# EAGLE design march_23_20_power_board1_v2.0 (EAGLE 9.5.1)
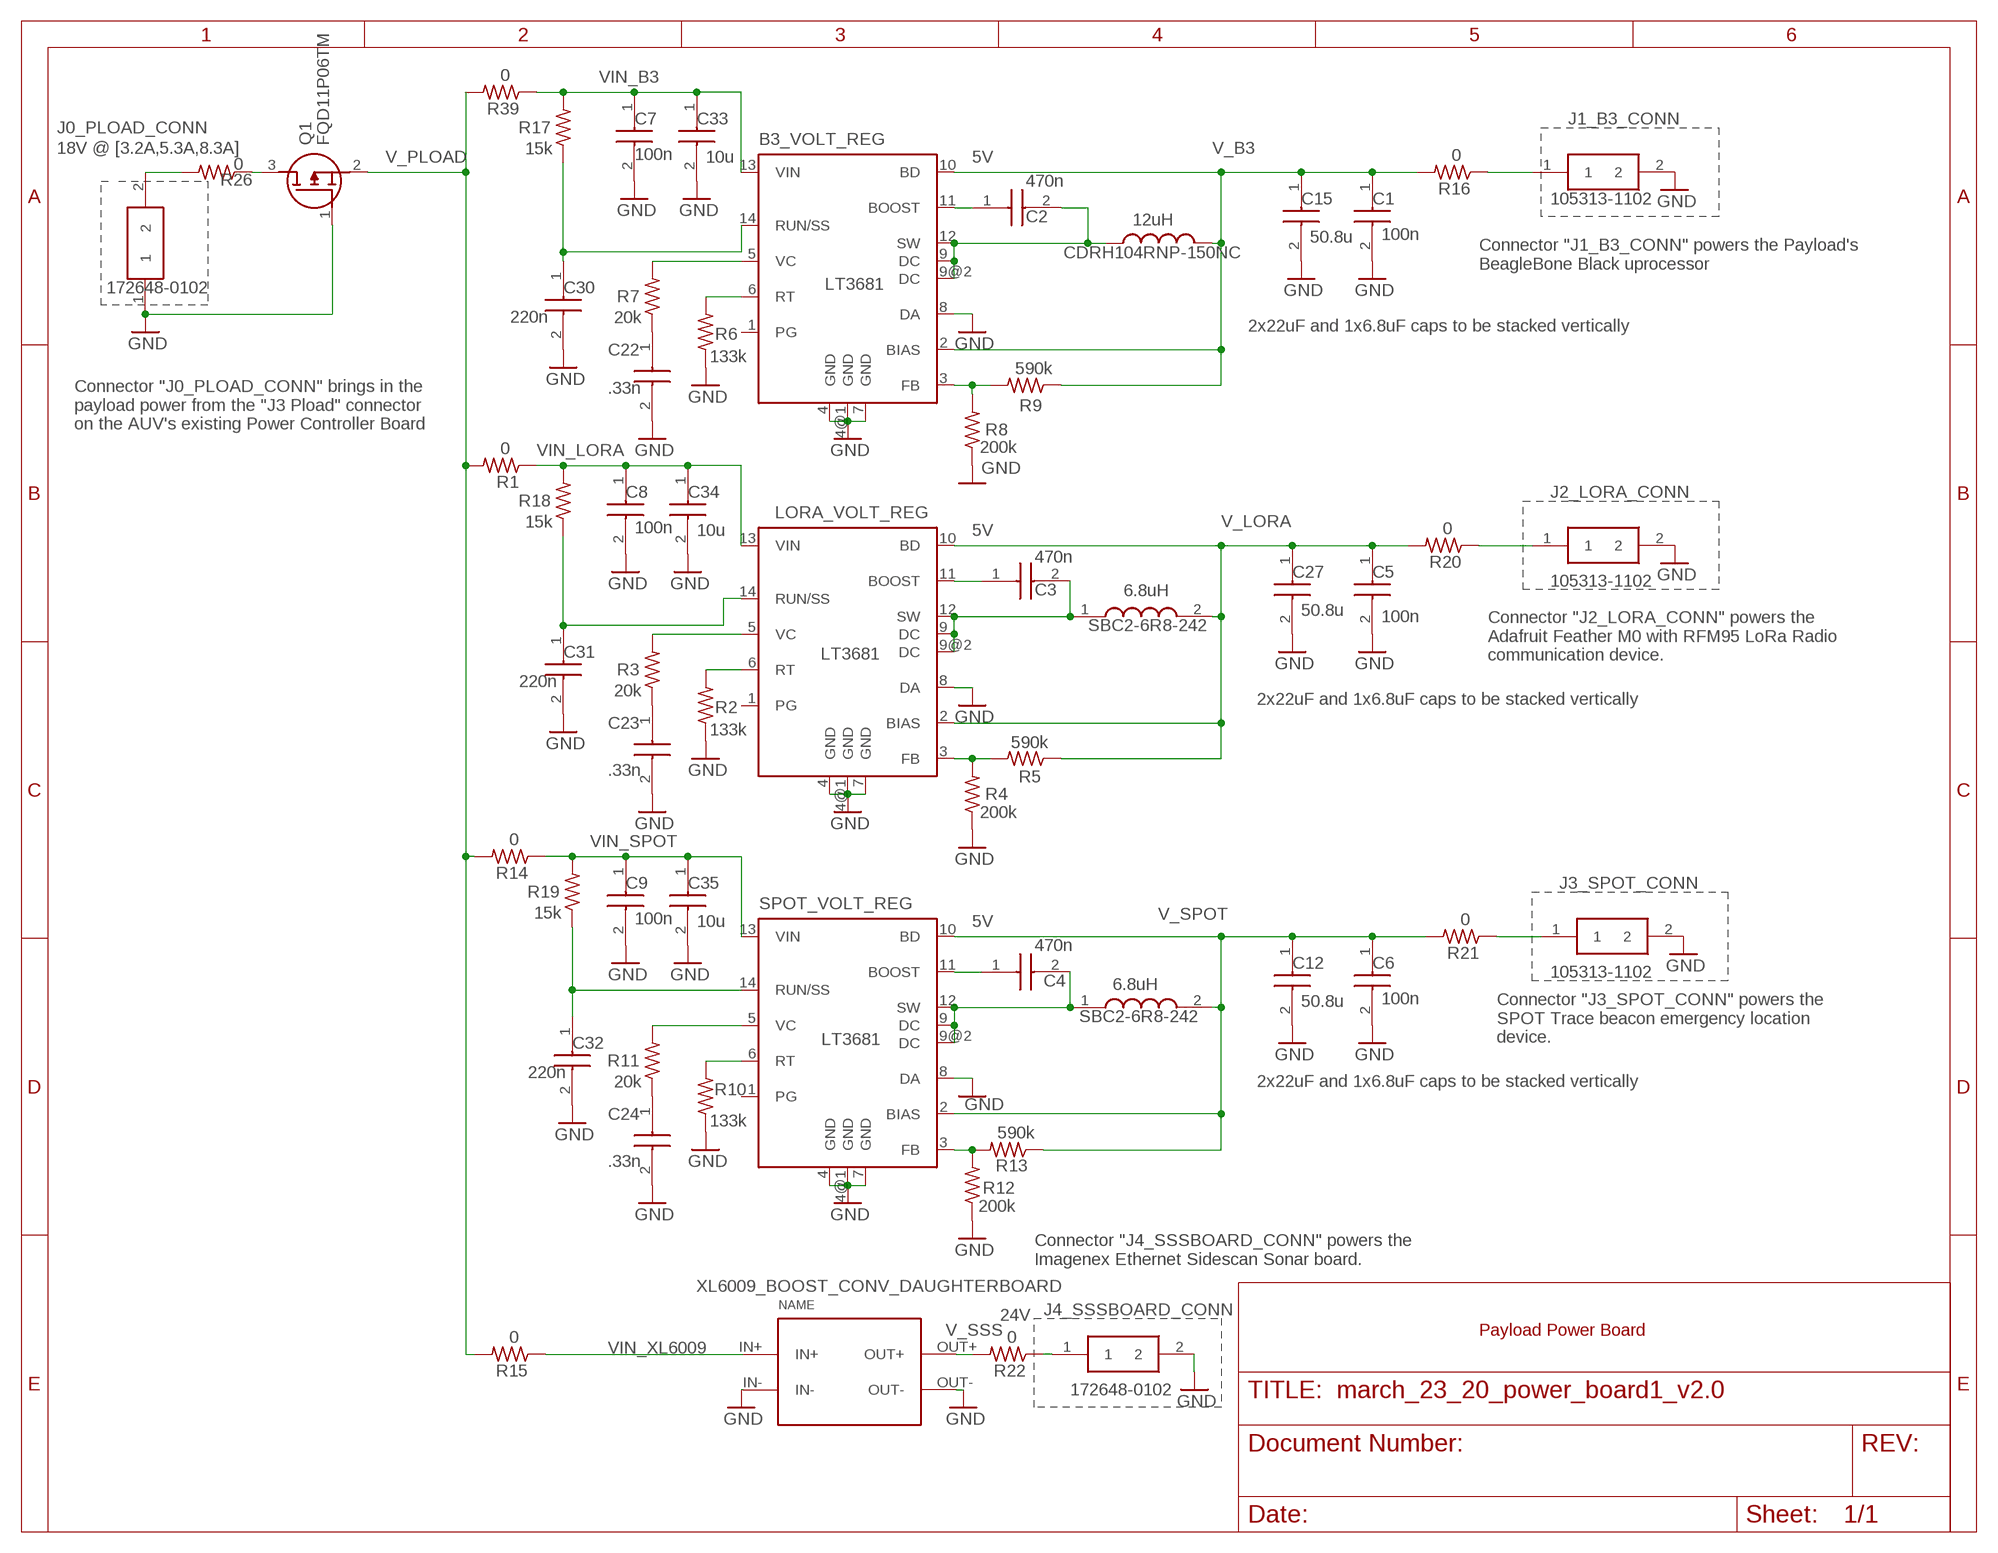
[diagram p0: schematic, sheet 1]

## Parts
B3_VOLT_REG  LT3681  [DFN14-4X3DE]
C1  100n  06033C104KAT4A  [CAPC1608X90N]
C2  470n  06033C474JAT2A  [CAPC1608X90N]
C3  470n  06033C474JAT2A  [CAPC1608X90N]
C4  470n  06033C474JAT2A  [CAPC1608X90N]
C5  100n  06033C104KAT4A  [CAPC1608X90N]
C6  100n  06033C104KAT4A  [CAPC1608X90N]
C7  100n  06031C104KAT2A  [CAPC1608X90N]
C8  100n  06031C104KAT2A  [CAPC1608X90N]
C9  100n  06031C104KAT2A  [CAPC1608X90N]
C12  50.8u  12103C226KAT2A  [CAPC3225X279N]
C15  50.8u  12103C226KAT2A  [CAPC3225X279N]
C22  .33n  08053C334KAT2A  [CAPC2012X140N]
C23  .33n  08053C334KAT2A  [CAPC2012X140N]
C24  .33n  08053C334KAT2A  [CAPC2012X140N]
C27  50.8u  12103C226KAT2A  [CAPC3225X279N]
C30  220n  08051C224KAT2A  [CAPC2012X140N]
C31  220n  08051C224KAT2A  [CAPC2012X140N]
C32  220n  08051C224KAT2A  [CAPC2012X140N]
C33  10u  22201C106KAT2A  [CAPC5750X279N]
C34  10u  22201C106KAT2A  [CAPC5750X279N]
C35  10u  22201C106KAT2A  [CAPC5750X279N]
INDUCTOR_3  CDRH104RNP-150NC  [INDPM102100X400N]
J0_PLOAD_CONN  172648-0102  [1726480102]
J1_B3_CONN  105313-1102  [1053131102]
J2_LORA_CONN  105313-1102  [1053131102]
J3_SPOT_CONN  105313-1102  [1053131102]
J4_SSSBOARD_CONN  172648-0102  [1726480102]
L4  SBC2-6R8-242  [SBC26R8242]
L5  SBC2-6R8-242  [SBC26R8242]
LORA_VOLT_REG  LT3681  [DFN14-4X3DE]
Q1  FQD11P06TM  [DPAK3-CASE-369AS]
R1  0  R-US_0207/2V  [0207/2V]
R2  133k  R-US_R0603  [R0603]
R3  20k  R-US_R0603  [R0603]
R4  200k  R-US_R0603  [R0603]
R5  590k  R-US_R0603  [R0603]
R6  133k  R-US_R0603  [R0603]
R7  20k  R-US_R0603  [R0603]
R8  200k  R-US_R0603  [R0603]
R9  590k  R-US_R0603  [R0603]
R10  133k  R-US_R0603  [R0603]
R11  20k  R-US_R0603  [R0603]
R12  200k  R-US_R0603  [R0603]
R13  590k  R-US_R0603  [R0603]
R14  0  R-US_0207/2V  [0207/2V]
R15  0  R-US_0207/2V  [0207/2V]
R16  0  R-US_0207/2V  [0207/2V]
R17  15k  R-US_R0603  [R0603]
R18  15k  R-US_R0603  [R0603]
R19  15k  R-US_R0603  [R0603]
R20  0  R-US_0207/2V  [0207/2V]
R21  0  R-US_0207/2V  [0207/2V]
R22  0  R-US_0207/2V  [0207/2V]
R26  0  R-US_0207/2V  [0207/2V]
R39  0  R-US_0207/2V  [0207/2V]
SPOT_VOLT_REG  LT3681  [DFN14-4X3DE]
XL6009_BOOST_CONV_DAUGHTERBOARD  CP8-ADJ  [CP8-ADJ]

## Nets
CBOOST_B3: B3_VOLT_REG.11(BOOST) C2.1
CBOOST_LORA: C3.1 LORA_VOLT_REG.11(BOOST)
CBOOST_SPOT: C4.1 SPOT_VOLT_REG.11(BOOST)
FB_B3: B3_VOLT_REG.3(FB) R8.2 R9.2
FB_LORA: LORA_VOLT_REG.3(FB) R4.2 R5.2
FB_SPOT: R12.2 R13.2 SPOT_VOLT_REG.3(FB)
GND: B3_VOLT_REG.4(GND) B3_VOLT_REG.4@1(GND) B3_VOLT_REG.7(GND) B3_VOLT_REG.8(DA) C1.2 C5.2 C6.2 C7.2 C8.2 C9.2 C12.2 C15.2 C22.2 C23.2 C24.2 C27.2 C30.2 C31.2 C32.2 C33.2 C34.2 C35.2 J0_PLOAD_CONN.1 J1_B3_CONN.2 J2_LORA_CONN.2 J3_SPOT_CONN.2 J4_SSSBOARD_CONN.2 LORA_VOLT_REG.4(GND) LORA_VOLT_REG.4@1(GND) LORA_VOLT_REG.7(GND) LORA_VOLT_REG.8(DA) Q1.1(G) R2.1 R4.1 R6.1 R8.1 R10.1 R12.1 SPOT_VOLT_REG.4(GND) SPOT_VOLT_REG.4@1(GND) SPOT_VOLT_REG.7(GND) SPOT_VOLT_REG.8(DA) XL6009_BOOST_CONV_DAUGHTERBOARD.IN- XL6009_BOOST_CONV_DAUGHTERBOARD.OUT-
N$1: C22.1 R7.1
N$2: C23.1 R3.1
N$4: C24.1 R11.1
RT_B3: B3_VOLT_REG.6(RT) R6.2
RT_LORA: LORA_VOLT_REG.6(RT) R2.2
RT_SPOT: R10.2 SPOT_VOLT_REG.6(RT)
RUN/SS_B3: B3_VOLT_REG.14(RUN/SS) C30.1 R17.1
RUN/SS_LORA: C31.1 LORA_VOLT_REG.14(RUN/SS) R18.1
RUN/SS_SPOT: C32.1 R19.1 SPOT_VOLT_REG.14(RUN/SS)
SW_B3: B3_VOLT_REG.9(DC) B3_VOLT_REG.9@2(DC) B3_VOLT_REG.12(SW) C2.2 INDUCTOR_3.1
SW_LORA: C3.2 L5.1 LORA_VOLT_REG.9(DC) LORA_VOLT_REG.9@2(DC) LORA_VOLT_REG.12(SW)
SW_SPOT: C4.2 L4.1 SPOT_VOLT_REG.9(DC) SPOT_VOLT_REG.9@2(DC) SPOT_VOLT_REG.12(SW)
V_B3: B3_VOLT_REG.2(BIAS) B3_VOLT_REG.10(BD) C1.1 C15.1 INDUCTOR_3.2 R9.1 R16.2
V_B31: J1_B3_CONN.1 R16.1
V_LORA: C5.1 C27.1 L5.2 LORA_VOLT_REG.2(BIAS) LORA_VOLT_REG.10(BD) R5.1 R20.2
V_LORA1: J2_LORA_CONN.1 R20.1
V_PLOAD: Q1.2(S) R1.2 R14.2 R15.2 R39.2
V_PLOAD0: Q1.3(D) R26.1
V_PLOAD00: J0_PLOAD_CONN.2 R26.2
V_SPOT: C6.1 C12.1 L4.2 R13.1 R21.2 SPOT_VOLT_REG.2(BIAS) SPOT_VOLT_REG.10(BD)
V_SPOT1: J3_SPOT_CONN.1 R21.1
V_SSS: R22.2 XL6009_BOOST_CONV_DAUGHTERBOARD.OUT+
V_SSS1: J4_SSSBOARD_CONN.1 R22.1
VC_B3: B3_VOLT_REG.5(VC) R7.2
VC_LORA: LORA_VOLT_REG.5(VC) R3.2
VC_SPOT: R11.2 SPOT_VOLT_REG.5(VC)
VIN_B3: B3_VOLT_REG.13(VIN) C7.1 C33.1 R17.2 R39.1
VIN_LORA: C8.1 C34.1 LORA_VOLT_REG.13(VIN) R1.1 R18.2
VIN_SPOT: C9.1 C35.1 R14.1 R19.2 SPOT_VOLT_REG.13(VIN)
VIN_XL6009: R15.1 XL6009_BOOST_CONV_DAUGHTERBOARD.IN+
Unconnected: B3_VOLT_REG.1(PG) LORA_VOLT_REG.1(PG) SPOT_VOLT_REG.1(PG)

## Notes on the sheet
- 18V @ [3.2A,5.3A,8.3A]
- 10u | 5V
- 12uH
- 50.8u
- Connector "J1_B3_CONN" powers the Payload's
  BeagleBone Black uprocessor
- 220n
- 2x22uF and 1x6.8uF caps to be stacked vertically
- .33n
- Connector "J0_PLOAD_CONN" brings in the 
  payload power from the "J3 Pload" connector 
  on the AUV's existing Power Controller Board
- 10u | 5V
- 470n
- 6.8uH
- 50.8u
- Connector "J2_LORA_CONN" powers the 
  Adafruit Feather M0 with RFM95 LoRa Radio
  communication device.
- 220n
- 2x22uF and 1x6.8uF caps to be stacked vertically
- .33n
- 10u | 5V
- 6.8uH
- 50.8u
- Connector "J3_SPOT_CONN" powers the 
  SPOT Trace beacon emergency location
  device.
- 220n
- 2x22uF and 1x6.8uF caps to be stacked vertically
- .33n
- Connector "J4_SSSBOARD_CONN" powers the 
  Imagenex Ethernet Sidescan Sonar board.
- XL6009_BOOST_CONV_DAUGHTERBOARD
- 24V
- Payload Power Board

## Library data of the parts
B3_VOLT_REG LORA_VOLT_REG SPOT_VOLT_REG = linear-technology:LT3681: 36V, 2A, 2.8MHz Step-Down Switching Regulator with Integrated Power Schottky Diode Source: http://www.linear.com/pc/downloadDocument.do?navId=H0,C1,C1003,C1042,C1032,C1064,P38040,D25144; MPN: LT3681EDE#PBF; OC_FARNELL: 1627603; OC_NEWARK: 57M8550
C1 C5 C6 = 06033C104KAT4A:06033C104KAT4A: Multilayer Ceramic Capacitors MLCC - SMD/SMT 25volts 0.1uF 10% X7R Source: Datasheet <http://www.mouser.com/catalog/supplier/library/pdf/AVXSurfaceMountCeramic.pdf>; DESCRIPTION: Multilayer Ceramic Capacitors MLCC - SMD/SMT 25volts 0.1uF 10% X7R; HEIGHT: 0.9mm; MANUFACTURER_NAME: AVX; MANUFACTURER_PART_NUMBER: 06033C104KAT4A; MOUSER_PART_NUMBER: 581-06033C104KAT4A; MOUSER_PRICE-STOCK: https://www.mouser.com/Search/Refine.aspx?Keyword=581-06033C104KAT4A
C2-C4 = 06033C474JAT2A:06033C474JAT2A: Multilayer Ceramic Capacitors MLCC - SMD/SMT 25V 470nF X7R 0603 +5% Source: Datasheet <https://componentsearchengine.com/Datasheets/1/06031A100FAT2A.pdf>; DESCRIPTION: Multilayer Ceramic Capacitors MLCC - SMD/SMT 25V 470nF X7R 0603 +5%; HEIGHT: 0.9mm; MANUFACTURER_NAME: AVX; MANUFACTURER_PART_NUMBER: 06033C474JAT2A; MOUSER_PART_NUMBER: 581-06033C474JAT2A; MOUSER_PRICE-STOCK: https://www.mouser.com/Search/Refine.aspx?Keyword=581-06033C474JAT2A
C7-C9 = 06031C104KAT2A:06031C104KAT2A: AVX - 06031C104KAT2A - CAP, MLCC, X7R, 0.1UF, 100V, 0603 Source: Datasheet <https://componentsearchengine.com/Datasheets/1/06031A100FAT2A.pdf>; DESCRIPTION: AVX - 06031C104KAT2A - CAP, MLCC, X7R, 0.1UF, 100V, 0603; HEIGHT: 0.9mm; MANUFACTURER_NAME: AVX; MANUFACTURER_PART_NUMBER: 06031C104KAT2A; MOUSER_PART_NUMBER: 581-06031C104KAT2A; MOUSER_PRICE-STOCK: https://www.mouser.com/Search/Refine.aspx?Keyword=581-06031C104KAT2A
C12 C15 C27 = 12103C226KAT2A:12103C226KAT2A: Multilayer Ceramic Capacitors MLCC - SMD/SMT 25V 22uF X7R 1210 0.1 Source: Datasheet <https://componentsearchengine.com/Datasheets/1/12103C226KAT2A.pdf>; DESCRIPTION: Multilayer Ceramic Capacitors MLCC - SMD/SMT 25V 22uF X7R 1210 0.1; HEIGHT: 2.79mm; MANUFACTURER_NAME: AVX; MANUFACTURER_PART_NUMBER: 12103C226KAT2A; MOUSER_PART_NUMBER: 581-12103C226KAT2A; MOUSER_PRICE-STOCK: https://www.mouser.com/Search/Refine.aspx?Keyword=581-12103C226KAT2A
C22-C24 = 08053C334KAT2A:08053C334KAT2A: AVX 0805 Standard 0.33uF Ceramic Multilayer Capacitor, 25 V dc, +125 Source: Datasheet <http://datasheets.avx.com/X7RDielectric.pdf>; DESCRIPTION: AVX 0805 Standard 0.33uF Ceramic Multilayer Capacitor, 25 V dc, +125; HEIGHT: 1.4mm; MANUFACTURER_NAME: AVX; MANUFACTURER_PART_NUMBER: 08053C334KAT2A; MOUSER_PART_NUMBER: 581-08053C334KAT2A; MOUSER_PRICE-STOCK: https://www.mouser.com/Search/Refine.aspx?Keyword=581-08053C334KAT2A; RS_PART_NUMBER: 1747387; RS_PRICE-STOCK: http://uk.rs-online.com/web/p/products/1747387
C30-C32 = 08051C224KAT2A:08051C224KAT2A: Cap Ceramic 0.22uF 100V X7R 10% Pad SMD 0805 125C T/R Source: Datasheet <https://www.mouser.com/datasheet/2/40/X7RDielectric-777024.pdf>; DESCRIPTION: Cap Ceramic 0.22uF 100V X7R 10% Pad SMD 0805 125C T/R; HEIGHT: 1.4mm; MANUFACTURER_NAME: AVX; MANUFACTURER_PART_NUMBER: 08051C224KAT2A; MOUSER_PART_NUMBER: 581-08051C224KAT2A; MOUSER_PRICE-STOCK: https://www.mouser.com/Search/Refine.aspx?Keyword=581-08051C224KAT2A
C33-C35 = 22201C106KAT2A:22201C106KAT2A: Cap Ceramic 10uF 100V X7R 10% Pad SMD 2220 125C T/R Source: Datasheet <https://www.mouser.com/datasheet/2/40/X7RDielectric-777024.pdf>; DESCRIPTION: Cap Ceramic 10uF 100V X7R 10% Pad SMD 2220 125C T/R; HEIGHT: 2.79mm; MANUFACTURER_NAME: AVX; MANUFACTURER_PART_NUMBER: 22201C106KAT2A; MOUSER_PART_NUMBER: 581-22201C106KAT2A; MOUSER_PRICE-STOCK: https://www.mouser.com/Search/Refine.aspx?Keyword=581-22201C106KAT2A
INDUCTOR_3 = CDRH104RNP-150NC:CDRH104RNP-150NC: Fixed Inductors 15uH 3.1A Source: Datasheet <http://products.sumida.com/products/pdf/CDRH104R.pdf>; DESCRIPTION: Fixed Inductors 15uH 3.1A; HEIGHT: 4mm; MANUFACTURER_NAME: Sumida; MANUFACTURER_PART_NUMBER: CDRH104RNP-150NC; MOUSER_PART_NUMBER: 851-CDRH104RNP-150NC; MOUSER_PRICE-STOCK: https://www.mouser.com/Search/Refine.aspx?Keyword=851-CDRH104RNP-150NC
J0_PLOAD_CONN J4_SSSBOARD_CONN = 172648-0102:172648-0102: Board to Board & Mezzanine Connectors Source: Datasheet <https://www.molex.com/pdm_docs/sd/1726480102_sd.pdf>; DESCRIPTION: Board to Board & Mezzanine Connectors; HEIGHT: 5.4mm; MANUFACTURER_NAME: Molex; MANUFACTURER_PART_NUMBER: 172648-0102; MOUSER_PART_NUMBER: 538-172648-0102; MOUSER_PRICE-STOCK: https://www.mouser.com/Search/Refine.aspx?Keyword=538-172648-0102
J1_B3_CONN J2_LORA_CONN J3_SPOT_CONN = 105313-1102:105313-1102: Molex Nano-Fit 105313, 2.5mm Pitch, 2 Way, 1 Row, Right Angle PCB Header, Through Hole Source: Datasheet <https://www.molex.com/molex/products/datasheet.jsp?part=active/1053131102_PCB_HEADERS.xml&channel=Products&Lang=en-US>; DESCRIPTION: Molex Nano-Fit 105313, 2.5mm Pitch, 2 Way, 1 Row, Right Angle PCB Header, Through Hole; HEIGHT: 6.84mm; MANUFACTURER_NAME: Molex; MANUFACTURER_PART_NUMBER: 105313-1102; MOUSER_PART_NUMBER: 538-105313-1102; MOUSER_PRICE-STOCK: https://www.mouser.com/Search/Refine.aspx?Keyword=538-105313-1102; RS_PART_NUMBER: 1623686; RS_PRICE-STOCK: http://uk.rs-online.com/web/p/products/1623686
L4 L5 = SBC2-6R8-242:SBC2-6R8-242: Fixed Inductors 6.8uH 20% 2.4A DCR=50mOhms Source: Datasheet <https://www.mouser.com/datasheet/2/212/KEM_L9007_SBC-1102894.pdf>; DESCRIPTION: Fixed Inductors 6.8uH 20% 2.4A DCR=50mOhms; HEIGHT: 8mm; MANUFACTURER_NAME: Kemet; MANUFACTURER_PART_NUMBER: SBC2-6R8-242; MOUSER_PART_NUMBER: 80-SBC2-6R8-242; MOUSER_PRICE-STOCK: https://www.mouser.com/Search/Refine.aspx?Keyword=80-SBC2-6R8-242
Q1 = FQD11P06TM:FQD11P06TM: FQD11P06TM P-Channel MOSFET, 9.4 A, 60 V, 3-Pin DPAK ON Semiconductor Source: Datasheet <https://www.onsemi.com/pub/Collateral/FQU11P06-D.pdf>; DESCRIPTION: FQD11P06TM P-Channel MOSFET, 9.4 A, 60 V, 3-Pin DPAK ON Semiconductor; HEIGHT: mm; MANUFACTURER_NAME: ON Semiconductor; MANUFACTURER_PART_NUMBER: FQD11P06TM; MOUSER_PART_NUMBER: 512-FQD11P06TM; MOUSER_PRICE-STOCK: https://www.mouser.com/Search/Refine.aspx?Keyword=512-FQD11P06TM; RS_PART_NUMBER: 6710949P; RS_PRICE-STOCK: http://uk.rs-online.com/web/p/products/6710949P
R1 R14-R16 R20-R22 R26 R39 = rcl:R-US_: RESISTOR, American symbol; DESC: RES SMD 10K OHM 1% 1/8W 0805; MFR: Yageo; MPN: RC0805FR-0710KL; SPICEPREFIX: R
R2-R13 R17-R19 = rcl:R-US_: RESISTOR, American symbol; SPICEPREFIX: R
XL6009_BOOST_CONV_DAUGHTERBOARD = userlib:CP8-ADJ: Voltage regulator IN: 7-35V OUT: ADJ

## Board
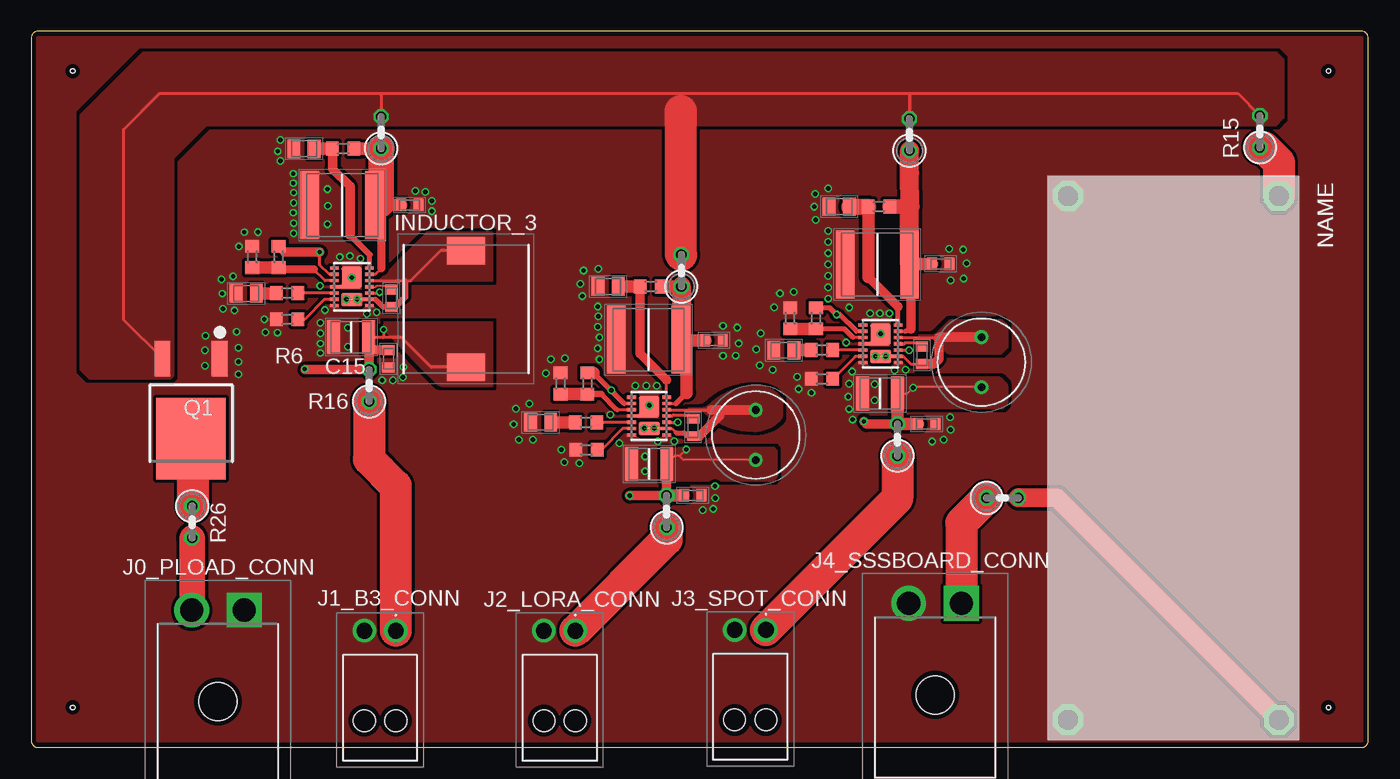
[diagram p1: board, top side]
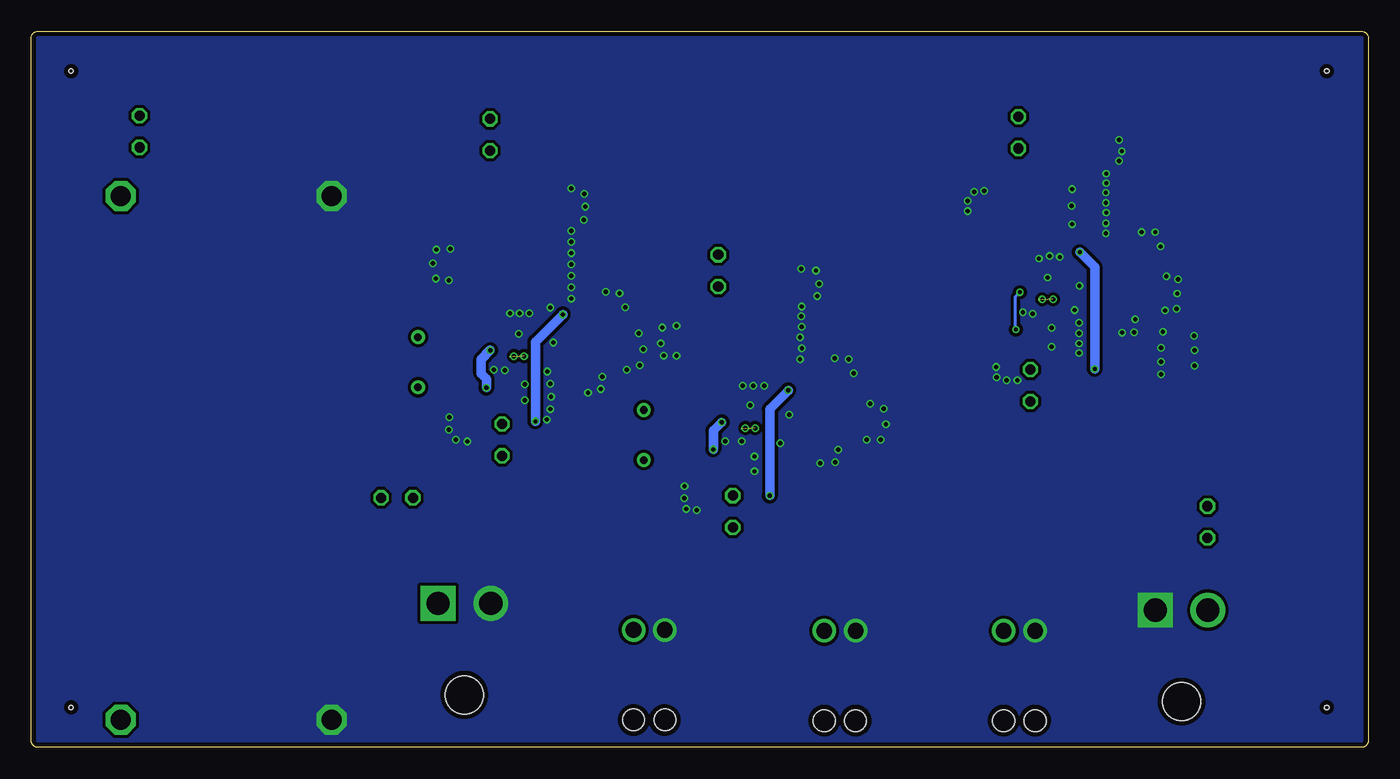
[diagram p2: board, bottom side, seen from below]

Size 106.68 x 57.15 mm. Coordinates in mm from the lower left corner, seen from the top.
Outline: 0.51,57.15 arc90 0,56.64 0,0.51 arc90 0.51,0 106.17,0 arc90 106.68,0.51 106.68,56.64 arc90 106.17,57.15 0.51,57.15
Copper layers (1*16): Top 0.035559375mm / dielectric 1.6mm / Bottom 0.035559375mm
Design rules "oshpark-2layer": minimum track width 6mil, minimum drill 10mil, track to track 6mil, track to pad 6mil, pad to pad 6mil, via to via 6mil, smd to smd 6mil, copper to edge 15mil, drill to drill 6mil, minimum pad ring 5mil, minimum via ring 5mil, stop-mask expansion 2.5mil, vias tented up to drill 0mil, thermal gap 10mil
Holes 0.35 mm at 103.5,53.98 103.5,3.17 3.3,53.98 3.3,3.17

### Footprints (pad centres in the part's own frame; a part is rotated, then mirrored left to right if it is on the bottom)
DFN14-4X3DE = smd 0.25 x 0.7: 1 -1.5,-1.4; 2 -1,-1.4; 3 -0.5,-1.4; 5 0.5,-1.4; 6 1,-1.4; 7 1.5,-1.4; 8 1.5,1.4; 10 0.5,1.4; 11 0,1.4; 12 -0.5,1.4; 13 -1,1.4; 14 -1.5,1.4 | smd 0.25 x 2: 4 0,-0.75; 9 1,0.75 | smd 1.75 x 1.65: 4@1 -0.75,0 | smd 1.07 x 1.65: 9@2 1,0
CAPC1608X90N = smd 0.78 x 0.99: 1 -0.7,0; 2 0.7,0
CAPC3225X279N = smd 1.02 x 2.72: 1 -1.4,0; 2 1.4,0
CAPC2012X140N = smd 1.02 x 1.47: 1 -0.81,0; 2 0.81,0
CAPC5750X279N = smd 1.47 x 5.41: 1 -2.57,0; 2 2.57,0
INDPM102100X400N = smd 2.2 x 3.05: 1 -4.65,0; 2 4.65,0
1726480102 = drill 1.85 pad 2.775 square: 1 0,0 | drill 1.85 pad 2.775: 2 -4.2,0 | hole 3.05: -2.1,-7.3
1053131102 = drill 1.25 pad 1.875: 1 0,0; 2 -2.5,0 | hole 1.75: 0,-7.18; -2.5,-7.18
SBC26R8242 = drill 0.6 pad 1.1: 1 0,0; 2 0,-4
DPAK3-CASE-369AS = smd 1.25 x 2.85: 1 -2.28,-6.4; 2 2.28,-6.4 | smd 5.55 x 6.5: 3 0,0
0207/2V = drill 0.813 octagon: 1 -1.27,0; 2 1.27,0
R0603 = smd 1 x 1.1: 1 -0.85,0; 2 0.85,0
CP8-ADJ = drill 1.6 octagon: IN+ -21.81,7.05; IN- -21.81,-9.75; OUT+ 19.99,7.05; OUT- 19.99,-9.75

### Placement (x,y rotation side)
B3_VOLT_REG  25.58,36.75 270 top
C1  28.5,31.01 270 top
C2  28.73,35.84 270 top
C3  52.81,25.53 270 top
C4  71.07,31.29 270 top
C5  52.78,20.12 0 top
C6  71.45,25.81 0 top
C7  30.2,43.28 0 top
C8  54.48,32.49 0 top
C9  72.57,38.58 0 top
C12  67.72,28.24 180 top
C15  25.53,32.74 180 top
C22  17.14,36.22 180 top
C23  40.64,25.93 180 top
C24  60.05,31.7 180 top
C27  49.3,22.61 180 top
C30  21.77,47.78 180 top
C31  46.02,36.78 180 top
C32  64.47,43.15 180 top
C33  24.82,43.28 180 top
C34  49.25,32.54 180 top
C35  67.51,38.53 180 top
INDUCTOR_3  34.69,34.99 270 top
J0_PLOAD_CONN  16.99,10.95 0 top
J1_B3_CONN  29.08,9.3 0 top
J2_LORA_CONN  43.41,9.3 0 top
J3_SPOT_CONN  58.62,9.37 0 top
J4_SSSBOARD_CONN  74.22,11.48 0 top
L4  75.82,32.74 0 top
L5  57.81,26.92 0 top
LORA_VOLT_REG  49.3,26.44 270 top
Q1  12.75,24.61 180 top
R1  51.87,38.05 90 top
R2  44.3,23.75 0 top
R3  44.27,25.93 0 top
R4  42.24,29.03 270 top
R5  44.37,29.03 270 top
R6  20.42,34.16 0 top
R7  20.42,36.25 0 top
R8  17.63,39.14 270 top
R9  19.74,39.14 270 top
R10  63.09,29.41 0 top
R11  63.09,31.7 0 top
R12  60.55,34.24 270 top
R13  62.61,34.24 270 top
R14  70.08,48.9 90 top
R15  98.04,49.15 90 top
R16  26.95,28.88 90 top
R17  24.89,47.78 0 top
R18  49.43,36.78 0 top
R19  67.64,43.15 0 top
R20  50.7,18.82 90 top
R21  69.11,24.54 90 top
R22  77.5,19.91 0 top
R26  12.83,17.98 270 top
R39  27.91,49.07 90 top
SPOT_VOLT_REG  67.77,32.21 270 top
XL6009_BOOST_CONV_DAUGHTERBOARD  92.48,22.2 270 top

### Tracks (layer width: path | path; a pad name or v marks a point on that pad's centre or on a via)
CBOOST_B3
  Top 0.152: B3_VOLT_REG.11 27.48,36.75 27.57,36.85 28.42,36.85 C2.1
CBOOST_LORA
  Top 0.254: LORA_VOLT_REG.11 51.15,26.44 51.24,26.54 52.5,26.54 C3.1
CBOOST_SPOT
  Top 0.254: SPOT_VOLT_REG.11 69.64,32.21 69.73,32.3 70.76,32.3 C4.1
FB_B3
  Top 0.254: B3_VOLT_REG.3 23.43,37.25 22.53,38.15
  Top 0.635: R9.2 19.88,38.15 22.53,38.15
  Top 1.016: R8.2 R9.2
FB_LORA
  Top 0.254: LORA_VOLT_REG.3 46.74,26.94
  Top 0.381: 46.74,26.94 45.5,28.18
  Top 0.508: 45.5,28.18 R5.2
  Top 1.016: R4.2 R5.2
FB_SPOT
  Top 0.254: SPOT_VOLT_REG.3 65.56,32.71
  Top 0.381: R13.2 64.88,33.39 65.56,32.71
  Top 1.016: R12.2 R13.2
GND  (via drill 0.33, 0.35)
  other vias: 20.9,45.8 20.9,45.03 20.93,44.27 20.93,43.46 20.9,42.67 20.93,41.83 20.93,41.02 23.06,33.88 23.06,32.23 23.06,31.47 23.06,33.05 23.04,36.83 26.26,39.01 25.43,39.22 24.61,39.14 16.99,41.12 15.24,36.22 19.63,33.1 18.59,34.16 16.21,34.87 16.56,39.98 19.66,47.57 25.58,37.49 68.48,34.65 67.72,34.65 66.93,34.65 27.56,34.72 23.42,34.9 19.89,48.49 19.89,46.81 31.95,42.8 31.95,43.61 31.45,44.35 16.1,37.59 28.85,29.31 27.99,29.31 63.6,41.22 63.6,40.34 63.6,39.45 63.6,38.56 63.6,37.64 63.6,36.73 63.6,35.81 62.56,44.17 62.46,43.15 62.59,42.09 65.02,32.31 65.51,30 69.77,30.15 48.21,28.85 49.07,28.85 49.91,28.85 49.3,27.3 46.2,26.54 46.91,24.26 51.31,24.43 67.79,32.99 18.67,33.12 25.25,33.48 25.25,31.98 30.66,44.4 26.77,34.59 29.64,29.54 29.69,30.35 16.54,29.77 16.54,30.78 16.54,31.9 16.38,33.17 13.89,32.84 13.84,31.7 13.84,30.45 43.74,22.68 42.55,22.76 42.29,23.75 40.03,24.54 38.91,24.56 38.48,25.78 38.66,27.03 39.73,27.43 41.05,29.84 41.45,30.96 42.57,31.06 45.21,35.18 45.24,34.42 45.21,33.58 45.34,32.72 45.19,31.85 45.34,30.96 45.24,38.2 44.07,38.05 43.81,37.01 43.97,36.02 55.19,33.66 56.34,33.5 56.46,32.23 56.21,31.27 55.19,31.24 53.57,18.92 54.41,19.02 54.58,19.89 54.56,20.83 48.97,23.22 48.97,22.02 59.74,36.25 58.19,33.05 57.86,31.78 58.12,30.51 59.16,30.15 61.11,29.57 61.24,28.6 62.26,28.3 65.28,29.03 65.2,27.97 65.25,27 65.56,26.16 68.91,30.1 67.28,28.98 67.28,27.71 73.33,26.34 73.36,25.35 72.8,24.54 71.88,24.41 73.25,39.8 74.35,39.73 74.65,38.63 74.4,37.41 73.36,37.29 63.58,44.63 65.25,35.1 15.29,35 15.16,37.36 18.08,41.12 23.62,44.55 23.67,43.21 23.62,41.76 49.99,24.43 60.83,36.35 59.28,35.13
  pour Top (isolate 0.254, rank 6, no thermals): -0.13,-0.2 107.14,-0.2 107.14,57.3 -0.13,57.3
  pour Bottom (isolate 0.254, rank 6, no thermals): -0.13,57.3 107.14,57.3 107.14,-0.2 -0.13,-0.2
N$1
  Top 0.254: R7.1 19.45,36.22
  Top 1.016: 19.45,36.22 C22.1
N$2
  Top 1.016: C23.1 R3.1
N$4
  Top 1.016: R11.1 C24.1
RT_B3
  Top 0.254: B3_VOLT_REG.6 23.38,35.75 21.79,34.16 R6.2
RT_LORA
  Top 0.254: LORA_VOLT_REG.6 47.18,25.44 45.49,23.75 R2.2
RT_SPOT
  Top 0.254: SPOT_VOLT_REG.6 65.75,31.21 63.96,29.41 R10.2
RUN/SS_B3
  Top 0.381: B3_VOLT_REG.14 26.98,39.32
  Top 0.508: 26.98,39.32 25.43,40.87
  Top 0.762: 25.43,40.87 25.43,44.78 24.04,46.16 R17.1
  Top 1.016: R17.1 C30.1
RUN/SS_LORA
  Top 0.254: LORA_VOLT_REG.14 50.7,28.07 50.7,29.31
  Top 0.762: R18.1 48.58,31.43 50.7,29.31
  Top 1.016: C31.1 R18.1
RUN/SS_SPOT
  Top 0.381: SPOT_VOLT_REG.14 69.17,35.18
  Top 0.762: 69.17,35.18 66.79,37.55
  Top 1.016: 66.79,37.55 R19.1
  Top 1.27: C32.1 R19.1
SW_B3  (via drill 0.33)  (3 unrouted)
  Top 0.152: 27.42,35.75 27.47,35.75 | C2.2 29.02,35.14
  Top 0.254: B3_VOLT_REG.12 29.74,37.25 | 29.74,37.25 30.27,37.25 32.66,39.64 INDUCTOR_3.1 | 29.82,37.18 29.74,37.25 | B3_VOLT_REG.9 27.42,35.75
  Top 0.381: 27.47,35.75 28.08,35.14 C2.2
  Top 0.508: 29.82,37.18 29.82,35.94 29.02,35.14
  other vias: 26.01,35.76 25.15,35.76
  pour Top (isolate 0.254, no thermals): 36.8,37.24 36.8,41.05 36.78,41.07 31.57,41.07 27.74,37.24
SW_LORA  (via drill 0.35)  (3 unrouted)
  Top 0.254: LORA_VOLT_REG.12 54.24,26.94 | 54.24,26.94 54.9,26.94 | 54.24,26.94 54.25,26.92 | LORA_VOLT_REG.9 51.11,25.44 51.46,25.09
  Top 0.381: C3.2 52.38,24.83 52.11,25.09 51.46,25.09
  Top 0.762: C3.2 53.26,24.83 54.9,26.46 54.9,26.94 | L5.1 54.25,26.92
  other vias: 48.92,25.48 49.71,25.48
  pour Top (isolate 0.254, no thermals): 52.45,27.1 53.64,27.1 arc45 54,27.25 arc-45 57.84,28.84 arc-45 59.64,28.1 59.92,27.81 59.92,26.57 arc-45 59.72,26.09 59.69,26.06 arc-45 57.65,25.22 arc-45 53.47,26.95 52.6,26.95
SW_SPOT  (via drill 0.35)  (3 unrouted)
  Top 0.254: SPOT_VOLT_REG.12 72.41,32.71 72.47,32.71 72.64,32.71 72.67,32.74 | SPOT_VOLT_REG.9 69.58,31.21 70.19,30.59 C4.2
  Top 0.762: 72.47,32.71 72.5,32.74 L4.1 | C4.2 72,30.59 72.41,31 72.41,32.71
  other vias: 67.36,31.22 68.17,31.22
  pour Top (isolate 0.254, no thermals): 70.82,32.89 71.87,32.89 arc45 72.23,33.04 73.16,33.96 arc-45 73.51,34.11 77.23,34.11 arc-45 77.59,33.96 77.9,33.66 77.9,31.93 77.37,31.39 73.46,31.39 arc-45 72.98,31.6 71.83,32.74 70.97,32.74
V_B3  (via drill 0.33)
  Top 0.254: B3_VOLT_REG.2 23.77,37.75 23.01,38.51 v23.01,39.52 | C15.1 26.98,32.69 28.07,32.69 | INDUCTOR_3.2 31.91,30.34 29.57,32.69 28.07,32.69 | B3_VOLT_REG.10 27.77,36.25 27.79,36.27 v27.79,36.33 | v28.12,33.35 28.12,32.74 28.07,32.69 | 21.87,30.15 v21.82,30.2
  Top 0.762: 26.95,31.73 R16.2 21.87,30.15 | 26.95,31.73 26.95,32.66 26.98,32.69 | C1.1 26.96,31.71 26.95,31.73 | v23.01,39.52 20.2,39.52 R9.1
  Bottom 0.254: v27.79,36.33 28.14,35.97 28.14,33.38 v28.12,33.35
  Bottom 0.762: v21.82,30.2 21.82,38.33 v23.01,39.52
  pour Top (isolate 0.254, no thermals): 28.14,33.3 32.44,29 arc45 32.8,28.85 36.8,28.85 36.8,33.91 28.14,33.91
V_B31
  Top 2.54: R16.1 26.95,23.01 29.08,20.88 J1_B3_CONN.1
V_LORA  (via drill 0.35)
  Top 0.152: R20.2 | 52.06,20.09 C5.1 | v51.58,25.94 v51.59,25.93 | 51.71,23.24 51.34,23.24 C27.1 | 51.71,23.24 v52.25,23.77 | L5.2 52.03,22.92 51.71,23.24
  Top 0.254: LORA_VOLT_REG.2 47.31,27.44 | LORA_VOLT_REG.10 v51.58,25.94
  Top 0.381: 47.31,27.44 v46.27,28.49 44.87,29.88
  Top 0.762: C27.1 R20.2 | R20.2 v47.75,20.09
  Top 1.016: 44.87,29.88 R5.1 | R20.2 52.06,20.09
  Bottom 0.152: 52.25,25.27 52.25,25.17
  Bottom 0.762: 52.25,25.17 v52.25,23.77 | v46.27,28.49 47.75,27 v47.75,20.09 | v51.59,25.93 52.25,25.27
  pour Top (isolate 0.254, no thermals): 50.24,23.9 50.24,21.31 59.21,21.31 59.44,21.54 arc45 59.51,21.71 59.51,23.67 59.28,23.9
V_LORA1
  Top 2.54: R20.1 50.7,16.59 J2_LORA_CONN.1
V_PLOAD
  Top 0.254: R15.2 96.27,52.2 70.05,52.2 | 27.91,52.2 10.26,52.2 7.37,49.3 7.37,34.12 Q1.2 | 27.91,52.2 51.82,52.2 | 70.05,52.2 70.05,50.19 R14.2 | 27.91,52.2 R39.2 | 51.82,50.8 51.82,52.2 | 51.82,52.2 70.05,52.2
  Top 2.54: R1.2 51.82,39.37 51.82,50.8
  pour Top (isolate 0.254, no thermals): 11.06,29.39 4.67,29.39 3.94,30.12 3.94,50.5 8.94,55.5 99.34,55.5 99.92,54.91 99.92,50.24 99.29,49.61 13.94,49.61 11.32,46.98 11.32,29.64
V_PLOAD0
  Top 0.152: 12.88,19.25 R26.1
  Top 0.254: Q1.3 12.88,24.49
  Top 2.54: 12.88,24.49 12.88,19.25
V_PLOAD00
  Top 2.032: R26.2 12.83,14.22 12.83,10.98
  Top 2.54: 12.83,10.98 J0_PLOAD_CONN.2
V_SPOT  (via drill 0.35)
  Top 0.152: C12.1 69.9,28.25 v70.36,28.7 70.4,28.74 L4.2
  Top 0.254: 64.24,34.54 v64.26,34.54 | SPOT_VOLT_REG.2 65.83,33.21 | SPOT_VOLT_REG.10 v70.05,31.71 v70.05,31.7
  Top 0.381: R13.1 63.69,35.09 64.24,34.54 | 65.83,33.21 64.49,34.54 v64.26,34.54
  Top 0.762: C12.1 | R21.2 66.65,25.81 v66.45,26.01
  Top 1.016: C12.1 R21.2 C6.1
  Bottom 0.762: v70.36,28.7 70.36,29.41 70.79,29.84 70.79,30.96 v70.05,31.7 | v66.45,26.01 66.45,32.36 v64.26,34.54
  pour Top (isolate 0.254, no thermals): 68.66,29.54 77.11,29.54 arc-45 77.47,29.39 77.73,29.13 arc-45 77.88,28.77 77.88,27.64 arc-45 77.73,27.28 77.5,27.05 68.66,27.05
V_SPOT1
  Top 2.54: R21.1 69.11,19.86 J3_SPOT_CONN.1
V_SSS
  Top 1.524: XL6009_BOOST_CONV_DAUGHTERBOARD.OUT+ 81.83,19.91 R22.2
V_SSS1
  Top 2.54: R22.1 74.22,17.91 J4_SSSBOARD_CONN.1
VC_B3
  Top 0.254: B3_VOLT_REG.5 21.38,36.25 R7.2
VC_LORA
  Top 0.254: LORA_VOLT_REG.5 R3.2
VC_SPOT
  Top 0.254: SPOT_VOLT_REG.5 63.95,31.71 R11.2
VIN_B3
  Top 0.254: B3_VOLT_REG.13 27.47,37.75 27.94,38.23 | R17.2 25.77,47.8 | 27.91,43.31 27.94,43.28
  Top 0.635: 27.94,38.23 27.94,43.28
  Top 1.016: C33.1 27.94,43.28 C7.1 | 25.77,47.8 R39.1
  Top 2.032: R39.1 27.91,43.31
VIN_LORA
  Top 0.254: 51.87,32.58 C34.1 52.3,32.54 | LORA_VOLT_REG.13 51.44,27.44
  Top 0.381: 51.44,27.44 52.3,28.3
  Top 1.016: 52.3,32.49 C8.1 | 52.3,28.3 52.3,32.49 | 52.3,32.49 52.3,32.54 | R18.2 R1.1
  Top 1.524: R1.1 51.87,32.58
VIN_SPOT
  Top 0.254: SPOT_VOLT_REG.13 69.75,33.21 | 70.19,38.43 C35.1
  Top 0.406: 69.75,33.21 70.19,33.4
  Top 0.762: 70.19,33.4 70.19,38.43 | 70.13,43.18 70.08,43.13 70.06,43.16
  Top 1.016: C9.1 70.13,38.58 C35.1
  Top 1.143: 70.06,43.16 R19.2
  Top 1.524: C35.1 70.08,43.13 | 70.13,43.18 70.08,45.85 R14.1
VIN_XL6009
  Top 0.254: 99.56,44.03 XL6009_BOOST_CONV_DAUGHTERBOARD.IN+
  Top 2.54: R15.1 98.37,47.88 99.56,46.7 99.56,44.03